# EAGLE design pinball-mega-shield (EAGLE 7.3.0)
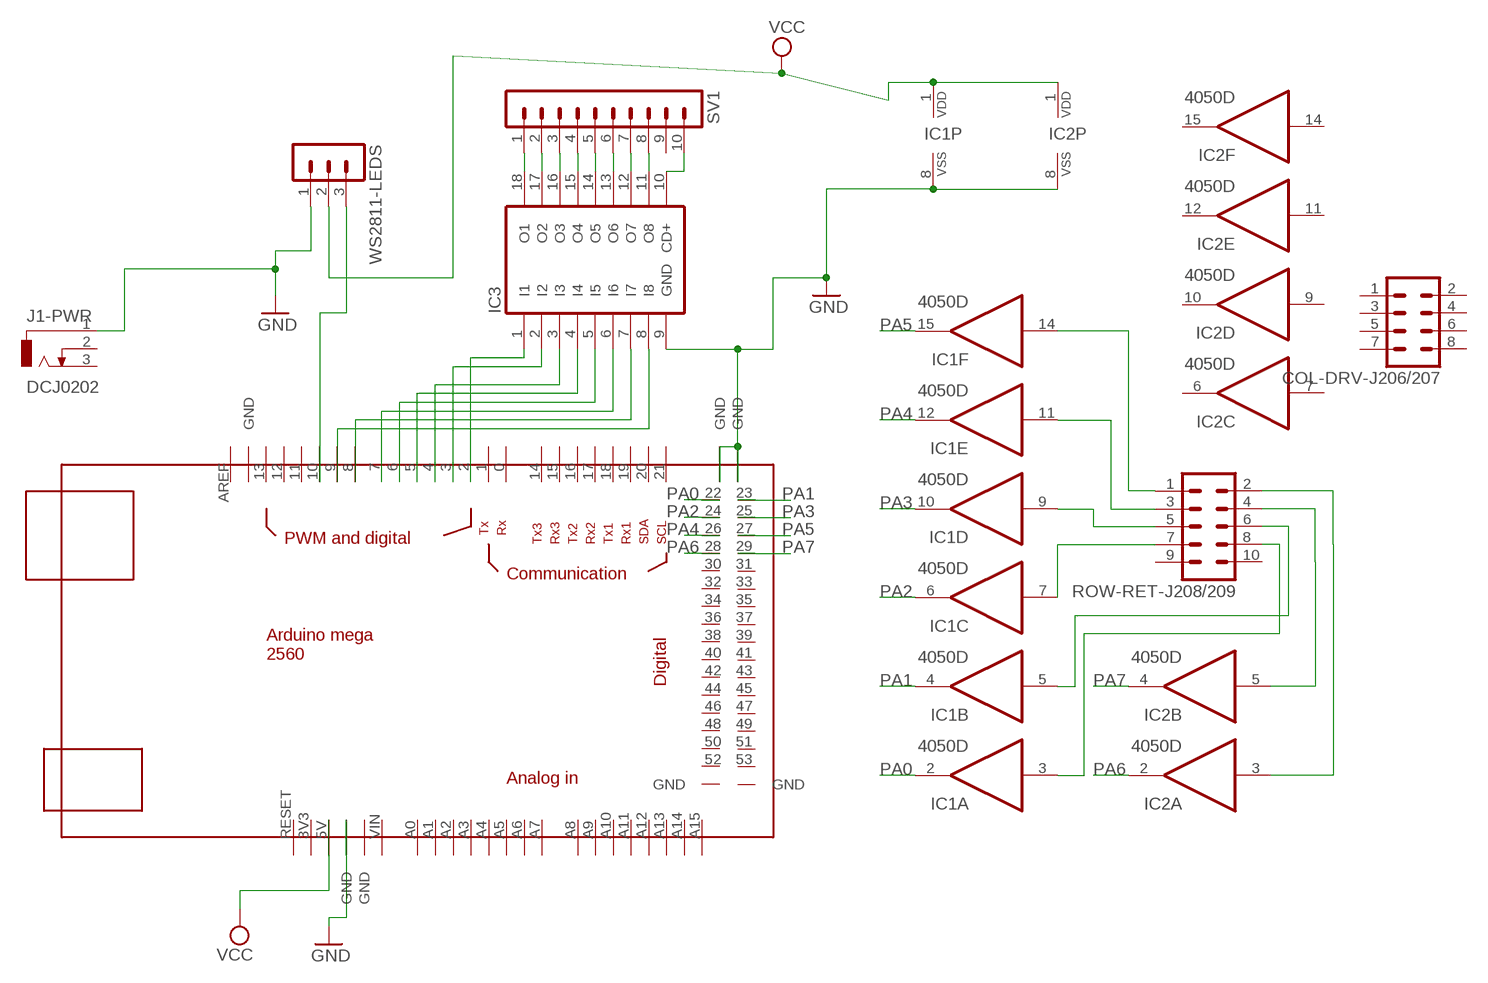
[diagram p0: schematic, sheet 1]

## Parts
COL-DRV-J206/207  MA04-2  [MA04-2]
IC1  4050D  [SO16]
IC2  4050D  [SO16]
IC3  ULN2803A  [DIL18]
J1-PWR  DCJ0202  [DCJ0202]
ROW-RET-J208/209  MA05-2  [MA05-2]
SV1  MA10-1  [MA10-1]
U$1  MEGA_DEVICE  [MEGAOUTLINE]
WS2811-LEDS  MA03-1  [MA03-1]

## Nets
GND: IC1.8(P:VSS) IC2.8(P:VSS) IC3.9(GND) J1-PWR.1 U$1.GND@2(GND) U$1.GND@4(GND) U$1.GND@5(GND) WS2811-LEDS.1
N$1: IC1.14(F:I) ROW-RET-J208/209.1
N$2: IC1.11(E:I) ROW-RET-J208/209.3
N$3: IC1.9(D:I) ROW-RET-J208/209.5
N$4: IC1.7(C:I) ROW-RET-J208/209.7
N$5: IC1.3(A:I) ROW-RET-J208/209.8
N$6: IC2.5(B:I) ROW-RET-J208/209.4
N$7: IC2.3(A:I) ROW-RET-J208/209.2
N$10: IC1.5(B:I) ROW-RET-J208/209.6
N$11: U$1.10 WS2811-LEDS.3
N$12: IC3.18(O1) SV1.1
N$13: IC3.17(O2) SV1.2
N$14: IC3.16(O3) SV1.3
N$15: IC3.15(O4) SV1.4
N$16: IC3.14(O5) SV1.5
N$17: IC3.13(O6) SV1.6
N$18: IC3.12(O7) SV1.7
N$19: IC3.11(O8) SV1.8
N$20: IC3.10(CD+) SV1.10
N$21: IC3.1(I1) U$1.2
N$22: IC3.2(I2) U$1.3
N$23: IC3.3(I3) U$1.4
N$24: IC3.4(I4) U$1.5
N$25: IC3.5(I5) U$1.6
N$26: IC3.6(I6) U$1.7
N$27: IC3.7(I7) U$1.8
N$28: IC3.8(I8) U$1.9
PA0: IC1.2(A:O) U$1.22
PA1: IC1.4(B:O) U$1.23
PA2: IC1.6(C:O) U$1.24
PA3: IC1.10(D:O) U$1.25
PA4: IC1.12(E:O) U$1.26
PA5: IC1.15(F:O) U$1.27
PA6: IC2.2(A:O) U$1.28
PA7: IC2.4(B:O) U$1.29
VCC: IC1.1(P:VDD) IC2.1(P:VDD) U$1.5V WS2811-LEDS.2
Unconnected: COL-DRV-J206/207.1 COL-DRV-J206/207.2 COL-DRV-J206/207.3 COL-DRV-J206/207.4 COL-DRV-J206/207.5 COL-DRV-J206/207.6 COL-DRV-J206/207.7 COL-DRV-J206/207.8 IC2.6(C:O) IC2.7(C:I) IC2.9(D:I) IC2.10(D:O) IC2.11(E:I) IC2.12(E:O) IC2.14(F:I) IC2.15(F:O) J1-PWR.2 J1-PWR.3 ROW-RET-J208/209.9 ROW-RET-J208/209.10 SV1.9 U$1.0 U$1.1 U$1.3V3 U$1.11 U$1.12 U$1.13 U$1.14 U$1.15 U$1.16 U$1.17 U$1.18 U$1.19 U$1.20 U$1.21 U$1.30 U$1.31 U$1.32 U$1.33 U$1.34 U$1.35 U$1.36 U$1.37 U$1.38 U$1.39 U$1.40 U$1.41 U$1.42 U$1.43 U$1.44 U$1.45 U$1.46 U$1.47 U$1.48 U$1.49 U$1.50 U$1.51 U$1.52 U$1.53 U$1.A0 U$1.A1 U$1.A2 U$1.A3 U$1.A4 U$1.A5 U$1.A6 U$1.A7 U$1.A8 U$1.A9 U$1.A10 U$1.A11 U$1.A12 U$1.A13 U$1.A14 U$1.A15 U$1.AREF U$1.GND@1(GND) U$1.GND@3(GND) U$1.GND@6(GND) U$1.GND@7(GND) U$1.RESET U$1.VIN

## Library data of the parts
COL-DRV-J206/207 = con-lstb:MA04-2: PIN HEADER; OC_FARNELL: unknown; OC_NEWARK: unknown
IC1 IC2 = 40xx:4050: Hex non-inverting BUFFER
IC3 = uln-udn:ULN2803A: DRIVER ARRAY
J1-PWR = con-jack:DCJ0202: DC POWER JACK Source: DCJ0202.pdf; OC_FARNELL: unknown; OC_NEWARK: unknown
ROW-RET-J208/209 = con-lstb:MA05-2: PIN HEADER; OC_FARNELL: unknown; OC_NEWARK: unknown
SV1 = con-lstb:MA10-1: PIN HEADER; OC_FARNELL: unknown; OC_NEWARK: unknown
U$1 = ArduinoMegaOutline:MEGA_DEVICE: mega card as device
WS2811-LEDS = con-lstb:MA03-1: PIN HEADER; OC_FARNELL: unknown; OC_NEWARK: unknown

## Board
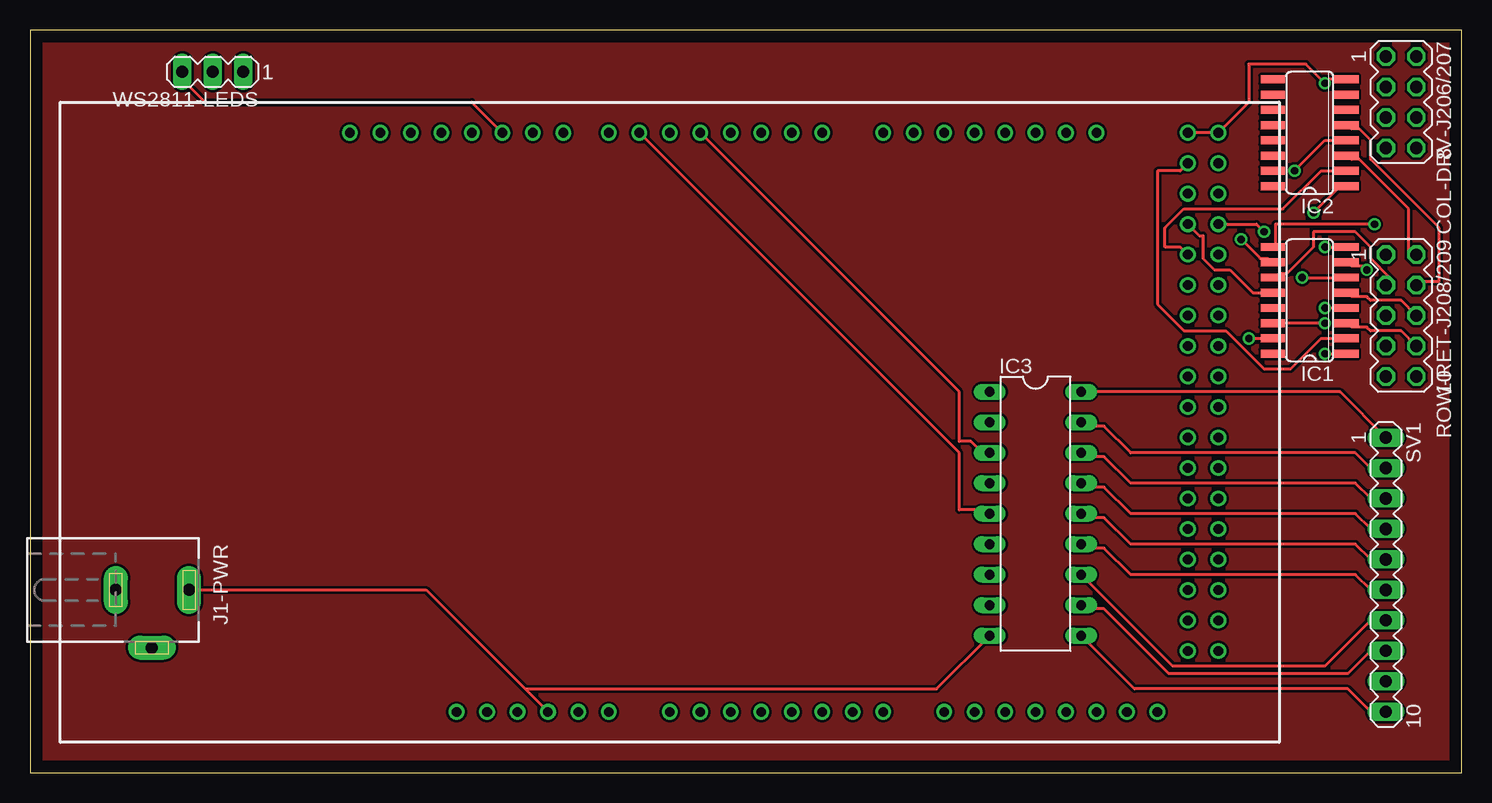
[diagram p1: board, top side]
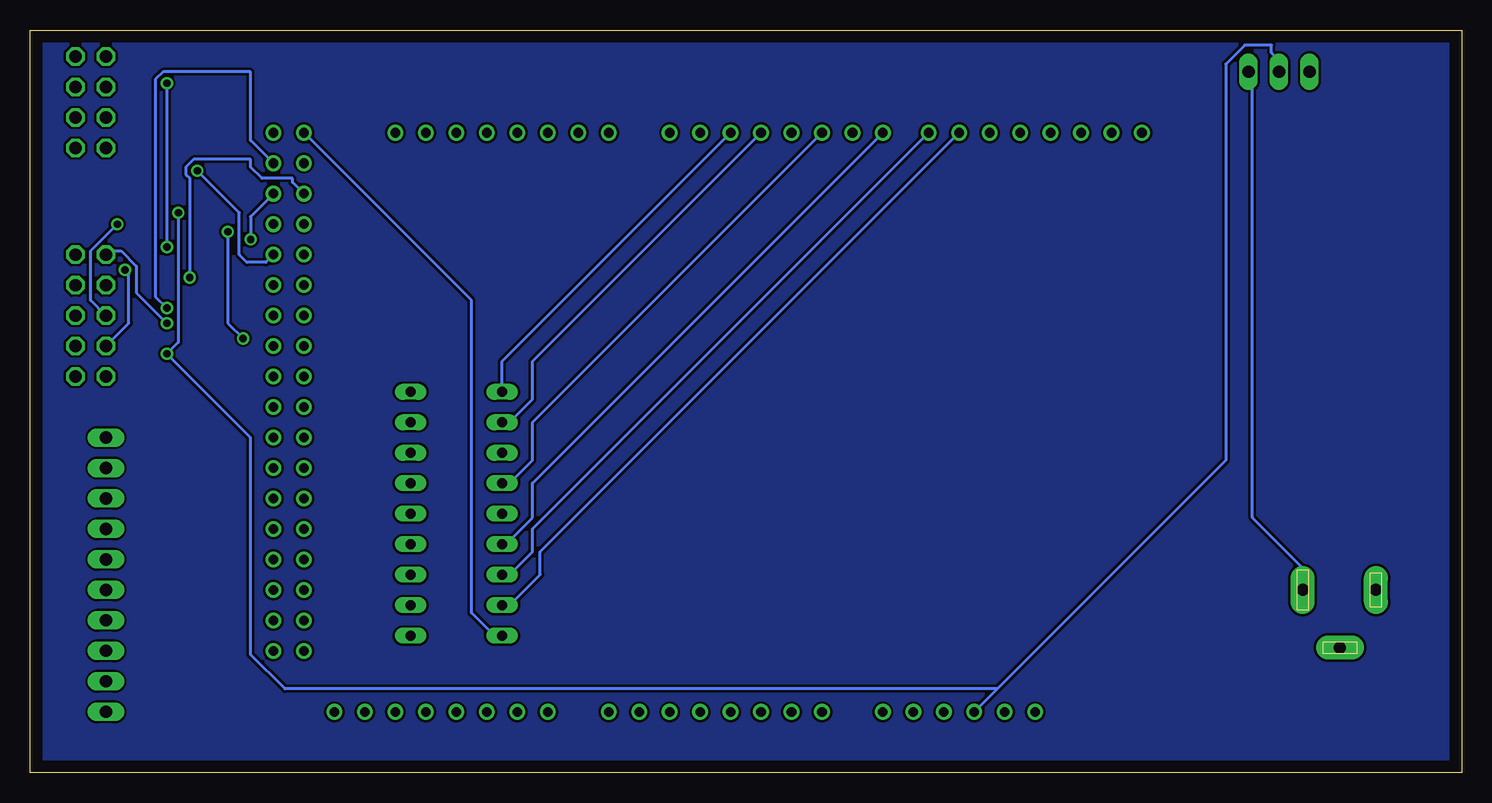
[diagram p2: board, bottom side, seen from below]

Size 119.36 x 61.9 mm. Coordinates in mm from the lower left corner, seen from the top.
Outline: 0,0 119.36,0 119.36,61.9 0,61.9 0,0
Copper layers (1*16): Top 0.035mm / dielectric 1.5mm / Bottom 0.035mm
Design rules "default": minimum track width 10mil, minimum drill 24mil, track to track 8mil, track to pad 8mil, pad to pad 8mil, via to via 8mil, smd to smd 8mil, copper to edge 40mil, drill to drill 8mil, minimum pad ring 10mil, minimum via ring 8mil, stop-mask expansion 4mil, vias tented up to drill 0mil, thermal gap 10mil

### Footprints (pad centres in the part's own frame; a part is rotated, then mirrored left to right if it is on the bottom)
MA04-2 = drill 1.016 octagon: 1 -3.81,-1.27; 2 -3.81,1.27; 3 -1.27,-1.27; 4 -1.27,1.27; 5 1.27,-1.27; 6 1.27,1.27; 7 3.81,-1.27; 8 3.81,1.27
SO16 = smd 0.66 x 2.032: 1 -4.445,-3.073; 2 -3.175,-3.073; 3 -1.905,-3.073; 4 -0.635,-3.073; 5 0.635,-3.073; 6 1.905,-3.073; 7 3.175,-3.073; 8 4.445,-3.073; 9 4.445,3.073; 10 3.175,3.073; 11 1.905,3.073; 12 0.635,3.073; 13 -0.635,3.073; 14 -1.905,3.073; 15 -3.175,3.073; 16 -4.445,3.073
DIL18 = drill 0.813 long: 1 -10.16,-3.81; 2 -7.62,-3.81; 3 -5.08,-3.81; 4 -2.54,-3.81; 5 0,-3.81; 6 2.54,-3.81; 7 5.08,-3.81; 8 7.62,-3.81; 9 10.16,-3.81; 10 10.16,3.81; 11 7.62,3.81; 12 5.08,3.81; 13 2.54,3.81; 14 0,3.81; 15 -2.54,3.81; 16 -5.08,3.81; 17 -7.62,3.81; 18 -10.16,3.81
DCJ0202 = drill 1 pad 2 long: 1 0,3.1; 2 4.8,0; 3 0,-3
MA05-2 = drill 1.016 octagon: 1 -5.08,-1.27; 2 -5.08,1.27; 3 -2.54,-1.27; 4 -2.54,1.27; 5 0,-1.27; 6 0,1.27; 7 2.54,-1.27; 8 2.54,1.27; 9 5.08,-1.27; 10 5.08,1.27
MA10-1 = drill 1.016 long: 1 -11.43,0; 2 -8.89,0; 3 -6.35,0; 4 -3.81,0; 5 -1.27,0; 6 1.27,0; 7 3.81,0; 8 6.35,0; 9 8.89,0; 10 11.43,0
MEGAOUTLINE = drill 0.8: 0 12.7,24.13; 1 10.16,24.13; 2 7.62,24.13; 3 5.08,24.13; 3V3 -15.24,-24.13; 4 2.54,24.13; 5 0,24.13; 5V -12.7,-24.13; 6 -2.54,24.13; 7 -5.08,24.13; 8 -8.89,24.13; 9 -11.43,24.13; 10 -13.97,24.13; 11 -16.51,24.13; 12 -19.05,24.13; 13 -21.59,24.13; 14 17.78,24.13; 15 20.32,24.13; 16 22.86,24.13; 17 25.4,24.13; 18 27.94,24.13; 19 30.48,24.13; 20 33.02,24.13; 21 35.56,24.13; 22 43.18,21.59; 23 45.72,21.59; 24 43.18,19.05; 25 45.72,19.05; 26 43.18,16.51; 27 45.72,16.51; 28 43.18,13.97; 29 45.72,13.97; 30 43.18,11.43; 31 45.72,11.43; 32 43.18,8.89; 33 45.72,8.89; 34 43.18,6.35; 35 45.72,6.35; 36 43.18,3.81; 37 45.72,3.81; 38 43.18,1.27; 39 45.72,1.27; 40 43.18,-1.27; 41 45.72,-1.27; 42 43.18,-3.81; 43 45.72,-3.81; 44 43.18,-6.35; 45 45.72,-6.35; 46 43.18,-8.89; 47 45.72,-8.89; 48 43.18,-11.43; 49 45.72,-11.43; 50 43.18,-13.97; 51 45.72,-13.97; 52 43.18,-16.51; 53 45.72,-16.51; A0 0,-24.13; A1 2.54,-24.13; A2 5.08,-24.13; A3 7.62,-24.13; A4 10.16,-24.13; A5 12.7,-24.13; A6 15.24,-24.13; A7 17.78,-24.13; A8 22.86,-24.13; A9 25.4,-24.13; A10 27.94,-24.13; A11 30.48,-24.13; A12 33.02,-24.13; A13 35.56,-24.13; A14 38.1,-24.13; A15 40.64,-24.13; AREF -26.67,24.13; GND@1 -24.13,24.13; GND@2 -10.16,-24.13; GND@3 -7.62,-24.13; GND@4 43.18,24.13; GND@5 45.72,24.13; GND@6 43.18,-19.05; GND@7 45.72,-19.05; RESET -17.78,-24.13; VIN -5.08,-24.13
MA03-1 = drill 1.016 long: 1 -2.54,0; 2 0,0; 3 2.54,0

### Placement (x,y rotation side)
COL-DRV-J206/207  114.3,55.88 270 top
IC1  106.68,39.37 90 top
IC2  106.68,53.34 90 top
IC3  83.82,21.59 270 top
J1-PWR  10.16,15.24 270 top
ROW-RET-J208/209  114.3,38.1 270 top
SV1  113.03,16.51 270 top
U$1  53.34,29.21 0 top
WS2811-LEDS  15.24,58.42 180 top

### Tracks (layer width: path | path; a pad name or v marks a point on that pad's centre or on a via)
GND  (via drill 0.61)
  Top 0.254: U$1.GND@4 U$1.GND@5 101.6,55.88 101.6,59.05 106.36,59.05 v107.95,57.47 108.27,57.78 109.54,57.78 IC2.8 | v107.95,43.81 109.54,43.81 IC1.8 | 41.27,6.99 33.02,15.24 13.34,15.24 J1-PWR.1 | 41.27,6.99 U$1.GND@2 | IC3.9 75.56,6.99 41.27,6.99
  Bottom 0.254: v107.95,57.47 v107.95,43.81 | WS2811-LEDS.1 17.46,58.1 17.46,21.27 13.34,17.14 13.34,15.24 J1-PWR.1 | U$1.GND@4 82.55,39.37 82.55,13.34 80.64,11.43 IC3.9
N$1  (via drill 0.61)
  Top 0.254: v107.95,37.47 103.82,37.47 IC1.14
  Bottom 0.254: v107.95,37.47 110.49,40.01 110.49,42.23 111.76,43.5 113.03,43.5 ROW-RET-J208/209.1
N$2
  Top 0.254: ROW-RET-J208/209.3 113.35,40.64 113.35,41.27 111.76,42.86 111.76,43.81 110.49,45.09 107,45.09 107,43.81 104.78,41.59 104.14,41.59 103.82,41.27 IC1.11
N$3  (via drill 0.61)
  Top 0.254: v112.08,45.72 103.82,45.72 103.82,43.81 IC1.9
  Bottom 0.254: v112.08,45.72 114.3,43.5 114.3,39.37 ROW-RET-J208/209.5
N$4  (via drill 0.61)
  Top 0.254: v111.44,41.91 111.12,42.23 110.17,42.23 109.86,42.55 IC1.7
  Bottom 0.254: v111.44,41.91 111.12,41.59 111.12,37.47 ROW-RET-J208/209.7
N$5
  Top 0.254: ROW-RET-J208/209.8 114.3,36.83 111.76,36.83 111.44,37.15 110.17,37.15 109.86,37.47 IC1.3
N$6
  Top 0.254: ROW-RET-J208/209.4 115.89,40.96 117.47,40.96 117.47,45.4 111.76,51.12 111.76,52.7 110.81,53.66 110.17,53.66 109.86,53.98 IC2.5
N$7
  Top 0.254: ROW-RET-J208/209.2 114.94,43.18 114.94,46.99 110.81,51.12 110.17,51.12 109.86,51.44 IC2.3
N$8
  pour Bottom: 0,62.23 119.38,62.23 119.38,0 0,0
N$9
  pour Top: 0,62.23 119.38,62.23 119.38,0 0,0
N$10
  Top 0.254: ROW-RET-J208/209.6 114.3,39.37 111.76,39.37 111.44,39.69 110.17,39.69 109.86,40.01 IC1.5
N$11
  Top 0.254: U$1.10 36.83,55.88 14.61,55.88 12.7,57.78 WS2811-LEDS.3
N$12
  Top 0.254: IC3.18 109.22,31.75 SV1.1
N$13
  Top 0.254: IC3.17 87.95,28.89 89.53,28.89 91.76,26.67 110.49,26.67 111.76,25.4 SV1.2
N$14
  Top 0.254: IC3.16 87.95,26.35 89.53,26.35 91.76,24.13 110.49,24.13 111.76,22.86 SV1.3
N$15
  Top 0.254: IC3.15 87.95,23.81 89.53,23.81 91.76,21.59 110.49,21.59 111.76,20.32 SV1.4
N$16
  Top 0.254: IC3.14 87.95,21.27 89.53,21.27 91.76,19.05 110.49,19.05 111.76,17.78 SV1.5
N$17
  Top 0.254: IC3.13 87.95,18.73 89.53,18.73 91.76,16.51 110.49,16.51 111.76,15.24 SV1.6
N$18
  Top 0.254: IC3.12 95.25,8.89 107.95,8.89 111.76,12.7 SV1.7
N$19
  Top 0.254: IC3.11 87.95,13.65 89.53,13.65 94.93,8.26 109.86,8.26 111.76,10.16 SV1.8
N$20
  Top 0.254: IC3.10 92.08,6.99 109.86,6.99 111.76,5.08 SV1.10
N$21
  Bottom 0.254: U$1.2 80.01,34.29 IC3.1
N$22
  Bottom 0.254: U$1.3 77.47,34.29 77.47,31.11 79.38,29.21 IC3.2
N$23
  Top 0.254: U$1.4 77.47,31.75 77.47,27.62 78.42,27.62 79.38,26.67 IC3.3
N$24
  Bottom 0.254: U$1.5 77.47,29.21 77.47,26.04 79.38,24.13 IC3.4
N$25
  Top 0.254: U$1.6 77.47,26.67 77.47,21.91 79.69,21.91 IC3.5
N$26
  Bottom 0.254: U$1.7 77.47,24.13 77.47,21.27 79.69,19.05 IC3.6
N$27
  Bottom 0.254: U$1.8 77.47,20.32 77.47,18.41 79.38,16.51 IC3.7
N$28
  Bottom 0.254: U$1.9 76.83,18.41 76.83,16.51 79.38,13.97 IC3.8
PA0
  Top 0.254: U$1.22 95.89,50.16 93.98,50.16 93.98,39.05 96.2,36.83 99.69,36.83 102.87,33.66 105.09,33.66 107.63,36.2 109.54,36.2 IC1.2
PA1  (via drill 0.61)
  Top 0.254: v107.95,38.73 109.54,38.73 IC1.4
  Bottom 0.254: v107.95,38.73 108.9,39.69 108.9,57.78 108.27,58.42 100.97,58.42 100.97,52.7 U$1.23
PA2  (via drill 0.61)
  Top 0.254: v106.05,41.27 109.54,41.27 IC1.6
  Bottom 0.254: v106.05,41.27 106.05,49.53 106.36,49.85 106.36,50.48 105.73,51.12 100.97,51.12 100.97,50.48 100.01,49.53 97.47,49.53 97.47,49.21 U$1.24
PA3  (via drill 0.61)
  Top 0.254: v100.97,44.45 102.55,42.86 103.19,42.86 103.5,42.55 IC1.10
  Bottom 0.254: v100.97,44.45 100.97,46.35 U$1.25
PA4
  Top 0.254: U$1.26 97.47,44.77 97.79,44.77 97.79,42.86 98.74,41.91 100.01,41.91 101.92,40.01 103.5,40.01 IC1.12
PA5  (via drill 0.61)
  Top 0.254: v101.6,36.2 103.5,36.2 IC1.15 | v102.87,45.09 102.23,45.72 U$1.27
  Bottom 0.254: v101.6,36.2 102.87,37.47 v102.87,45.09
PA6
  Top 0.254: U$1.28 95.89,43.81 94.61,43.81 94.61,45.4 96.2,46.99 104.46,46.99 107.63,50.16 109.54,50.16 IC2.2
PA7  (via drill 0.61)
  Top 0.254: v105.41,50.16 107.95,52.7 109.54,52.7 IC2.4
  Bottom 0.254: v105.41,50.16 101.92,46.67 101.92,43.18 101.28,42.55 99.69,42.55 U$1.29
VCC  (via drill 0.61)
  Top 0.254: v107.95,34.92 109.54,34.92 IC1.1 | v107,46.67 109.22,48.9 109.54,48.9 IC2.1
  Bottom 0.254: v107,46.67 107,35.88 v107.95,34.92 100.97,27.94 100.97,9.84 98.11,6.99 38.73,6.99 | 38.73,6.99 19.68,26.04 19.68,59.05 18.1,60.64 15.88,60.64 15.88,60.01 15.24,59.37 WS2811-LEDS.2 | 38.73,6.99 U$1.5V